# Altium schematic sheet CC0402KRX7R7BB104.schdoc
size 127 x 101 mm
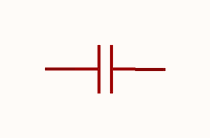
[diagram p0: CC0402KRX7R7BB104.schdoc]

## Parts
C?  cc0402krx7r7bb104  [C0402]  (value not drawn)

## Nets

Not connected (* = marked no-connect by the designer): C? 1 2

## Library data of the parts
C? = cc0402krx7r7bb104: 容值:100nF;精度:±10%;额定电压:16V;温度系数:X7R;; Manufacturer: YAGEO(国巨); AddInBom: yes; ModelId: 36a51122f27c49738f86b3bfa98863e0; ModelName: C0402_L1.0-W0.5-H0.5; ModelTransform: 39.37,19.685,0,0,0,0,0,0,0; Value: 100nF; Tolerance: ±10%; Voltage Rating: 16V; Temperature Coefficient: X7R; Symbol: CC0402KRX7R7BB104; LCSC Part Name: 100nF ±10% 16V; SupplierPart: C60474; ManufacturerPart: CC0402KRX7R7BB104; Supplier Footprint: 0402; JLCPCB Part Class: Extended Part; Datasheet: https://item.szlcsc.com/datasheet/CC0402KRX7R7BB104/61526.html; Supplier: LCSC; ConvertToPcb: yes; FootprintName: C0402